# EAGLE design heating_pad_5v_to_3v (EAGLE 9.6.2)
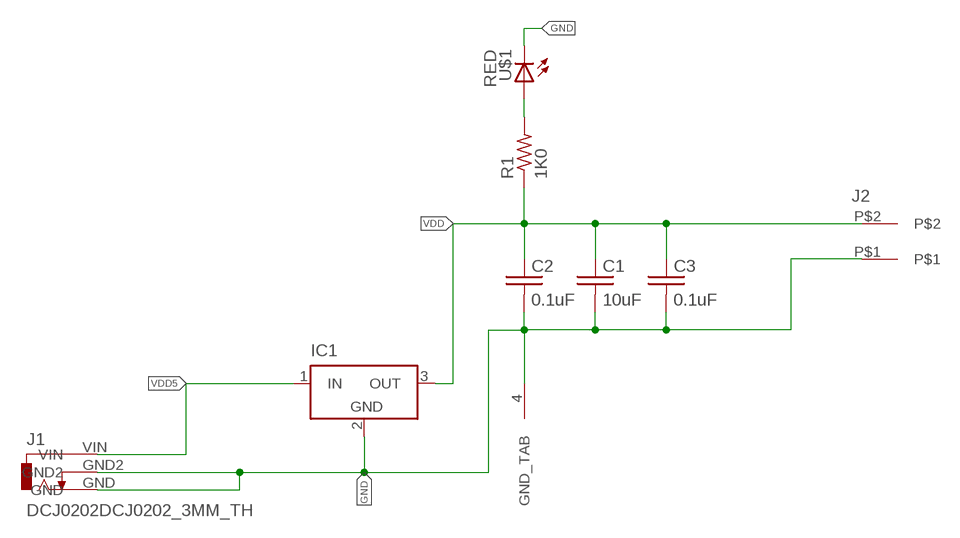
[diagram p0: schematic, sheet 1]

## Parts
C1  10uF  C_0402_10UF  [0402]
C2  0.1uF  C_0402_0.1UF  [0402]
C3  0.1uF  C_0402_0.1UF  [0402]
IC1  LT1129CST3  [SOT223]
J1  DCJ0202DCJ0202_3MM_TH  [DCJ0202_3MM_TH]
J2  2-pos  3.81MM_1_X_2_RT_ANGLE_PLUG_HEADER  [2_3.81MM_PITCH]
R1  1K0  R_0402_1K0  [0402]
U$1  LED_0805_RED  [LED_0805_RED]

## Nets
GND: C1.P$2 C2.P$2 C3.P$2 IC1.2(GND) IC1.4(GND_TAB) J1.GND J1.GND2 J2.P$1 U$1.C
N$1: R1.P$2 U$1.A
VDD: C1.P$1 C2.P$1 C3.P$1 IC1.3(OUT) J2.P$2 R1.P$1
VDD5: IC1.1(IN) J1.VIN

## Library data of the parts
C1 = 3D_MIG_Controller:C_0402_10UF; PARTNO: CL05A106MP8NUB8
C2 C3 = 3D_MIG_Controller:C_0402_0.1UF; PARTNO: CL05F104ZO5NNNC
IC1 = 3D_MIG_Controller:LT1129CST3: VOLTAGE REGULATOR with shutdown
J1 = 3D_MIG_Controller:DCJ0202: DC POWER JACK Source: DCJ0202.pdf
J2 = 3D_MIG_Controller:3.81MM_1_X_2_RT_ANGLE_PLUG_HEADER: TERM BLOCK HDR 2POS 90DEG 3.81MM; PARTNO: 691322310002
R1 = 3D_MIG_Controller:R_0402_1K0; PARTNO: CRG0402J1K0
U$1 = 3D_MIG_Controller:LED_0805_RED

## Board
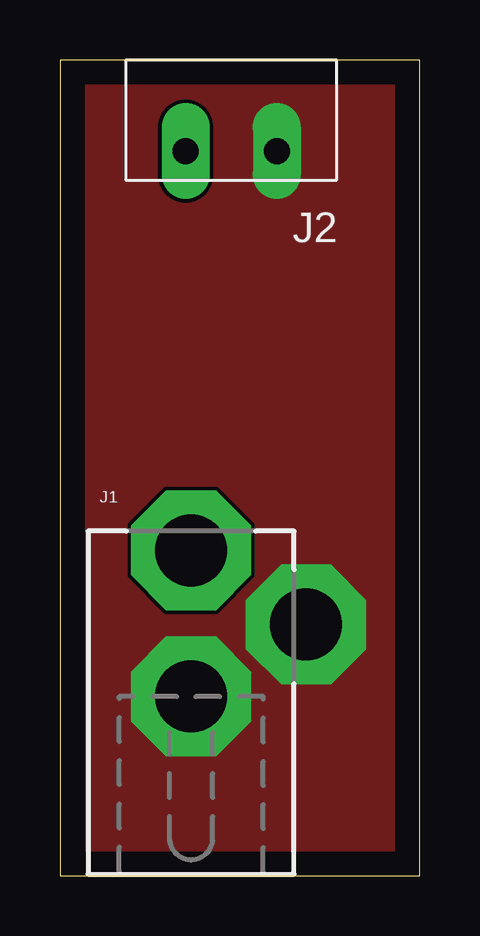
[diagram p1: board, top side]
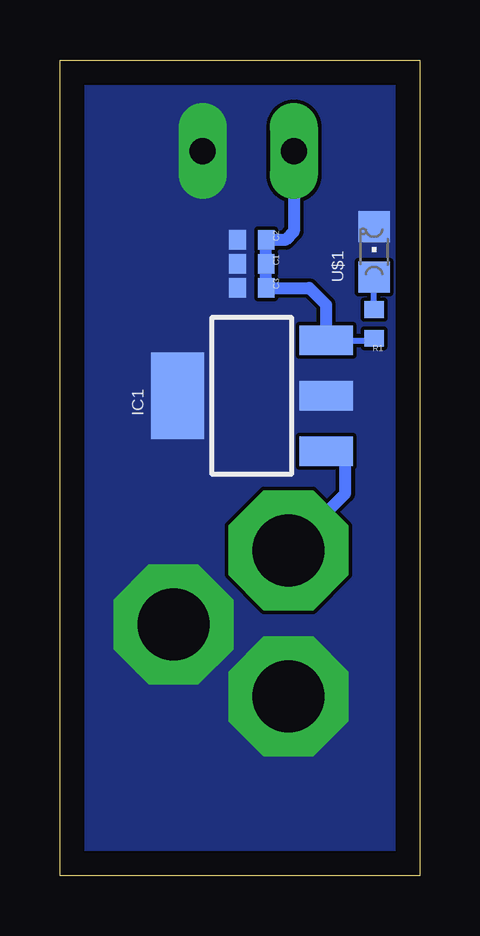
[diagram p2: board, bottom side, seen from below]

Size 15 x 34 mm. Coordinates in mm from the lower left corner, seen from the top.
Outline: 0,0 15,0 15,34 0,34 0,0
Copper layers (1*16): Top 0.035mm / dielectric 1.5mm / Bottom 0.035mm
Design rules "default": minimum track width 6mil, minimum drill 0.35mm, track to track 6mil, track to pad 6mil, pad to pad 6mil, via to via 6mil, smd to smd 6mil, copper to edge 40mil, drill to drill 6mil, minimum pad ring 10mil, minimum via ring 8mil, stop-mask expansion 4mil, vias tented up to drill 0mil, thermal gap 10mil

### Footprints (pad centres in the part's own frame; a part is rotated, then mirrored left to right if it is on the bottom)
0402 = smd 0.8 x 0.7: P$1 0,0.6; P$2 0,-0.6
SOT223 = smd 1.219 x 2.235: 1 -2.311,-3.099; 2 0,-3.099; 3 2.311,-3.099 | smd 3.6 x 2.2: 4 0,3.099
DCJ0202_3MM_TH = drill 3 pad 5 octagon: GND 4.8,0; GND2 0,-3; VIN 0,3.1
2_3.81MM_PITCH = drill 1.1 pad 2 long: P$1 0,0; P$2 3.81,0
LED_0805_RED = smd 1.3 x 1.3: A 0,-1.05; C 0,1.05

### Placement (x,y rotation side)
C1  7,25.5 270 bottom
C2  7,26.5 270 bottom
C3  7,24.5 270 bottom
IC1  7,20 90 bottom
J1  5.47,10.46 0 top
J2  9.05,30.2 180 top
R1  1.9,23 180 bottom
U$1  1.9,26 0 bottom

### Tracks (layer width: path | path; a pad name or v marks a point on that pad's centre or on a via)
GND
  pour Bottom (no thermals): 0,34 15,34 15,0 0,0
  pour Top (no thermals): 0,34 15,34 15,0 0,0
N$1
  Bottom 0.254: R1.P$2 U$1.A
VDD
  Bottom 0.254: IC1.3 1.9,22.31 R1.P$1
  Bottom 0.508: IC1.3 3.9,23.8 4.6,24.5 C3.P$1 C1.P$1 C2.P$1 5.6,26.5 5.24,26.86 J2.P$2
VDD5
  Bottom 0.508: J1.VIN 3.1,15.93 3.1,17.8 3.79,17.8 IC1.1